# Altium project PT-15-V1.0.PrjPcb (part 3 of 7)

## Sheet 04-ORIN_HIGH_SPEED_SIGNAL_2.SchDoc: KARGOBOT-TBOX-V2.0
size 513 x 386 mm; Page Create Date: March  8, 1995; Page Number: 7; Page Size: C; Page Count: 81; RevCode: A; DsnPath: C:\Users\Administrator\Desktop\123\KARGOBOT-TCU-ORIN-V1.1.DSN; SchematicName: KARGOBT-TCU-ORIN-V1.1; PageName: 07-ORIN_HIGH_SPEED_SIGNAL_2; PageSize: C; TopSchematic: True
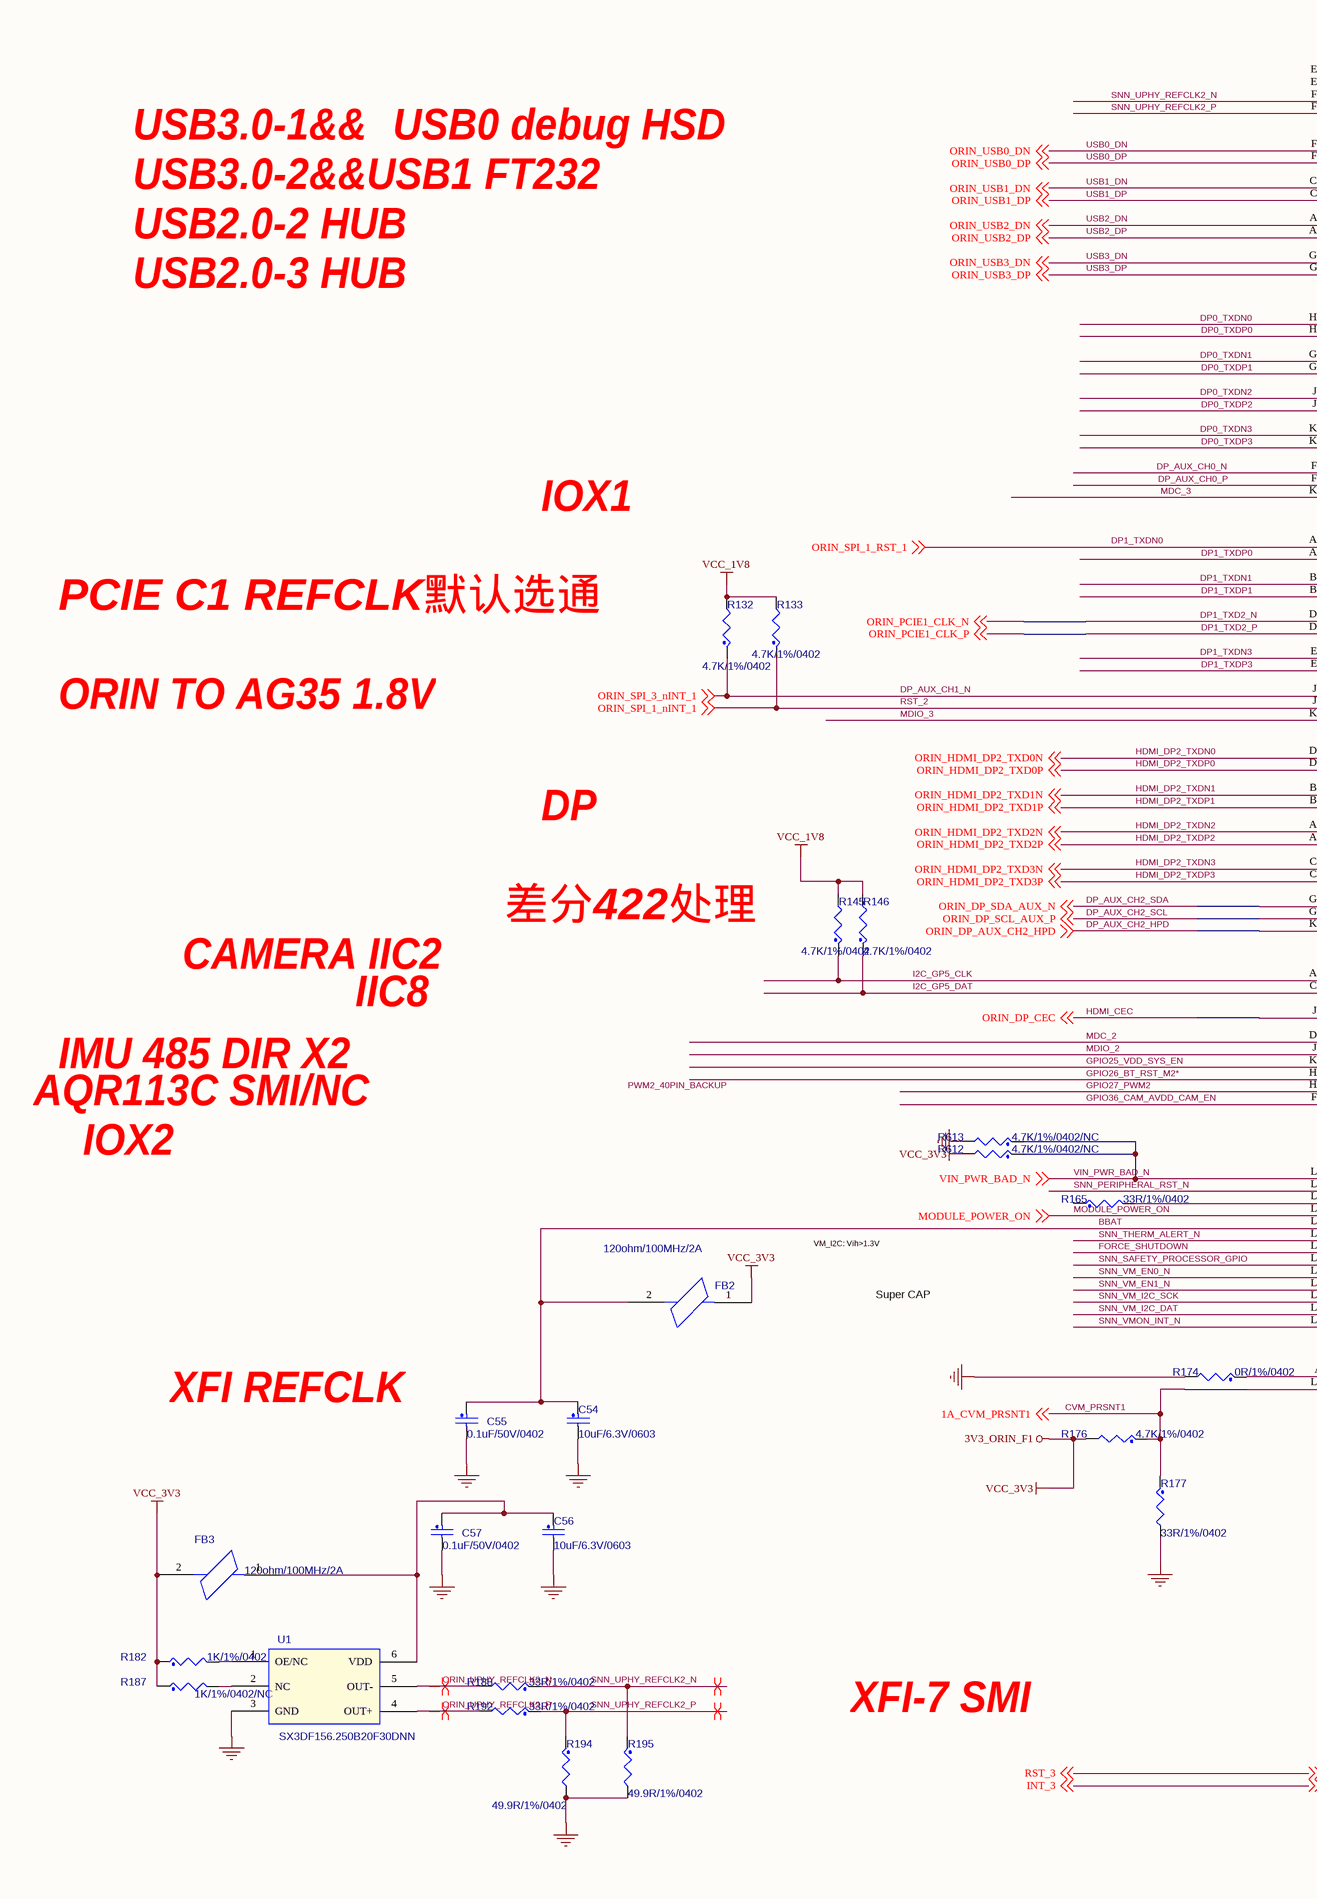
[diagram p6: 04-ORIN_HIGH_SPEED_SIGNAL_2.SchDoc, left]
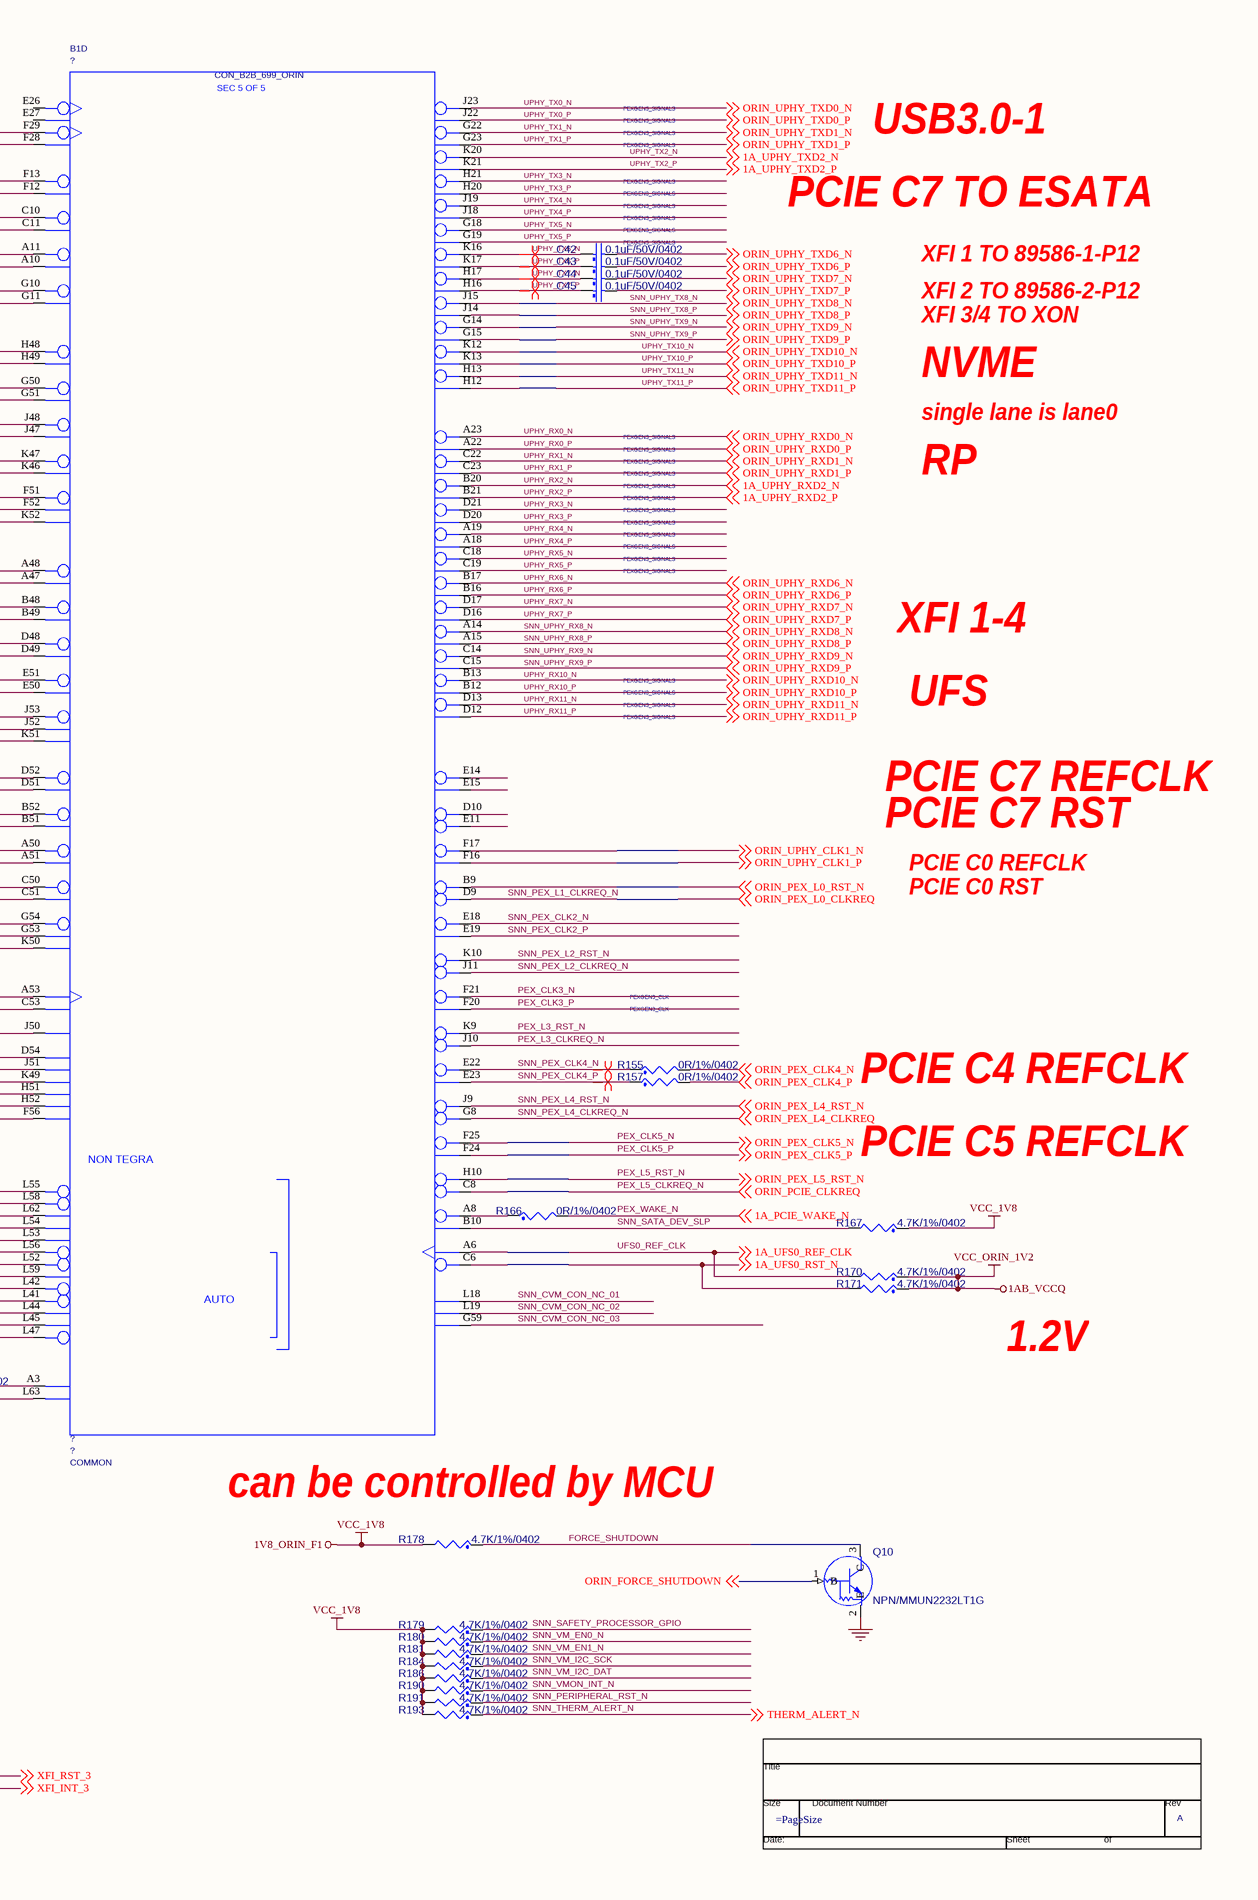
[diagram p7: 04-ORIN_HIGH_SPEED_SIGNAL_2.SchDoc, right]

### Parts
(Parts that share a designator on the sheet are numbered #1, #2 ... from top to bottom, then left to right.)
*#4  RevCode: A  (graphical)
B1  SKU: COMMON  [CON_MIRMEZ_699_BGA_ST_P009_P013_P015_REVERSE]  (hidden comment: CON_B2B_699_ORIN)  (part D of 5)
C42  value 0.1uF/50V/0402  [C0402]  (hidden comment: CAP_NP)
C43  value 0.1uF/50V/0402  [C0402]  (hidden comment: CAP_NP)
C44  value 0.1uF/50V/0402  [C0402]  (hidden comment: CAP_NP)
C45  value 0.1uF/50V/0402  [C0402]  (hidden comment: CAP_NP)
C54  value 10uF/6.3V/0603  [C0603]  (hidden comment: CAP_NP)
C55  value 0.1uF/50V/0402  [C0402]  (hidden comment: CAP_NP)
C56  value 10uF/6.3V/0603  [C0603]  (hidden comment: CAP_NP)
C57  value 0.1uF/50V/0402  [C0402]  (hidden comment: CAP_NP)
FB2  value 120ohm/100MHz/2A  [L0603]  (hidden comment: BEAD_FERRITE)
FB3  value 120ohm/100MHz/2A  [L0603]  (hidden comment: BEAD_FERRITE)
Q10  NPN/MMUN2232LT1G  [SOT-23]
R132  value 4.7K/1%/0402  [R0402]  (hidden comment: RES_Dup2)
R133  value 4.7K/1%/0402  [R0402]  (hidden comment: RES_Dup2)
R145  value 4.7K/1%/0402  [R0402]  (hidden comment: RES_Dup2)
R146  value 4.7K/1%/0402  [R0402]  (hidden comment: RES_Dup2)
R155  value 0R/1%/0402  [R0402]  (hidden comment: RES_Dup2)
R157  value 0R/1%/0402  [R0402]  (hidden comment: RES_Dup2)
R165  value 33R/1%/0402  [R0402]  (hidden comment: RES_Dup2)
R166  value 0R/1%/0402  [R0402]  (hidden comment: RES_Dup2)
R167  value 4.7K/1%/0402  [R0402]  (hidden comment: RES_Dup2)
R170  value 4.7K/1%/0402  [R0402]  (hidden comment: RES_Dup2)
R171  value 4.7K/1%/0402  [R0402]  (hidden comment: RES_Dup2)
R174  value 0R/1%/0402  [R0402]  (hidden comment: RES_Dup2)
R176  value 4.7K/1%/0402  [R0402]  (hidden comment: RES_Dup2)
R177  value 33R/1%/0402  [R0402]  (hidden comment: RES_Dup2)
R178  value 4.7K/1%/0402  [R0402]  (hidden comment: RES_Dup2)
R179  value 4.7K/1%/0402  [R0402]  (hidden comment: RES_Dup2)
R180  value 4.7K/1%/0402  [R0402]  (hidden comment: RES_Dup2)
R181  value 4.7K/1%/0402  [R0402]  (hidden comment: RES_Dup2)
R182  value 1K/1%/0402  [R0402]  (hidden comment: RES_Dup2)
R184  value 4.7K/1%/0402  [R0402]  (hidden comment: RES_Dup2)
R186  value 4.7K/1%/0402  [R0402]  (hidden comment: RES_Dup2)
R187  value 1K/1%/0402/NC  [R0402]  (hidden comment: RES_Dup2)
R188  value 33R/1%/0402  [R0402]  (hidden comment: RES_Dup2)
R190  value 4.7K/1%/0402  [R0402]  (hidden comment: RES_Dup2)
R191  value 4.7K/1%/0402  [R0402]  (hidden comment: RES_Dup2)
R192  value 33R/1%/0402  [R0402]  (hidden comment: RES_Dup2)
R193  value 4.7K/1%/0402  [R0402]  (hidden comment: RES_Dup2)
R194  value 49.9R/1%/0402  [R0402]  (hidden comment: RES_Dup2)
R195  value 49.9R/1%/0402  [R0402]  (hidden comment: RES_Dup2)
R612  value 4.7K/1%/0402/NC  [R0402]  (hidden comment: RES_Dup2)
R613  value 4.7K/1%/0402/NC  [R0402]  (hidden comment: RES_Dup2)
U1  SX3DF156.250B20F30DNN  [SX3DF156.250B20F30DNN]

### Nets
1AB_VCCQ: R170.1 R171.1  [also labelled VCC_ORIN_1V2]
1V8_ORIN_F1: R132.2 R133.2 R145.2 R146.2 R167.1 R178.2 R179.2 R180.2 R181.2 R184.2 R186.2 R190.2 R191.2 R193.2  [also labelled VCC_1V8]
3V3_ORIN_F1: FB2.1 FB3.2 R176.2 R182.1 R187.1 R612.2  [also labelled VCC_3V3]
GND: C54.2 C55.2 C56.2 C57.2 Q10.2(E) R174.2 R177.2 R194.2 R195.2 R613.2 U1.3(GND)
1A_UFS0_RST_N: B1.C6(UFS0_RST_N) R171.2 ; off-sheet 1A_UFS0_RST_N
BBAT: B1.L53(VCC_RTC) C54.1 C55.1 FB2.2
CVM_PRSNT1: B1.L63(PRSNT1) R176.1 R177.1 ; off-sheet 1A_CVM_PRSNT1  [also labelled 1A_CVM_PRSNT1]
DP0_TXDN0: B1.H48(HDMI_DP0_TX0_N)
DP0_TXDN1: B1.G50(HDMI_DP0_TX1_N)
DP0_TXDN2: B1.J48(HDMI_DP0_TX2_N)
DP0_TXDN3: B1.K47(HDMI_DP0_TX3_N)
DP0_TXDP0: B1.H49(HDMI_DP0_TX0_P)
DP0_TXDP1: B1.G51(HDMI_DP0_TX1_P)
DP0_TXDP2: B1.J47(HDMI_DP0_TX2_P)
DP0_TXDP3: B1.K46(HDMI_DP0_TX3_P)
DP1_TXD2_N: B1.D48(HDMI_DP1_TX2_N) ; off-sheet ORIN_PCIE1_CLK_N  [also labelled ORIN_PCIE1_CLK_N]
DP1_TXD2_P: B1.D49(HDMI_DP1_TX2_P) ; off-sheet ORIN_PCIE1_CLK_P  [also labelled ORIN_PCIE1_CLK_P]
DP1_TXDN0: B1.A48(HDMI_DP1_TX0_N) ; off-sheet ORIN_SPI_1_RST_1  [also labelled ORIN_SPI_1_RST_1]
DP1_TXDN1: B1.B48(HDMI_DP1_TX1_N)
DP1_TXDN3: B1.E51(HDMI_DP1_TX3_N)
DP1_TXDP0: B1.A47(HDMI_DP1_TX0_P)
DP1_TXDP1: B1.B49(HDMI_DP1_TX1_P)
DP1_TXDP3: B1.E50(HDMI_DP1_TX3_P)
DP_AUX_CH0_N: B1.F51(DP0_AUX_CH_N)
DP_AUX_CH0_P: B1.F52(DP0_AUX_CH_P)
DP_AUX_CH1_N: B1.J53(DP1_AUX_CH_N) R132.1 ; off-sheet ORIN_SPI_3_nINT_1  [also labelled ORIN_SPI_3_nINT_1]
DP_AUX_CH2_HPD: B1.K50(DP2_HPD) ; off-sheet ORIN_DP_AUX_CH2_HPD  [also labelled ORIN_DP_AUX_CH2_HPD]
DP_AUX_CH2_SCL: B1.G53(DP2_AUX_CH_P) ; off-sheet ORIN_DP_SCL_AUX_P  [also labelled ORIN_DP_SCL_AUX_P]
DP_AUX_CH2_SDA: B1.G54(DP2_AUX_CH_N) ; off-sheet ORIN_DP_SDA_AUX_N  [also labelled ORIN_DP_SDA_AUX_N]
FORCE_SHUTDOWN: B1.L52(OVERTEMP_N) Q10.3(C) R178.1
GPIO25_VDD_SYS_EN: B1.K49(GPIO25)
GPIO26_BT_RST_M2*: B1.H51(GPIO26)
GPIO27_PWM2: B1.H52(GPIO27)
GPIO36_CAM_AVDD_CAM_EN: B1.F56(GPIO36)
HDMI_CEC: B1.J50(HDMI_CEC) ; off-sheet ORIN_DP_CEC  [also labelled ORIN_DP_CEC]
HDMI_DP2_TXDN0: B1.D52(HDMI_DP2_TX0_N) ; off-sheet ORIN_HDMI_DP2_TXD0N  [also labelled ORIN_HDMI_DP2_TXD0N]
HDMI_DP2_TXDN1: B1.B52(HDMI_DP2_TX1_N) ; off-sheet ORIN_HDMI_DP2_TXD1N  [also labelled ORIN_HDMI_DP2_TXD1N]
HDMI_DP2_TXDN2: B1.A50(HDMI_DP2_TX2_N) ; off-sheet ORIN_HDMI_DP2_TXD2N  [also labelled ORIN_HDMI_DP2_TXD2N]
HDMI_DP2_TXDN3: B1.C50(HDMI_DP2_TX3_N) ; off-sheet ORIN_HDMI_DP2_TXD3N  [also labelled ORIN_HDMI_DP2_TXD3N]
HDMI_DP2_TXDP0: B1.D51(HDMI_DP2_TX0_P) ; off-sheet ORIN_HDMI_DP2_TXD0P  [also labelled ORIN_HDMI_DP2_TXD0P]
HDMI_DP2_TXDP1: B1.B51(HDMI_DP2_TX1_P) ; off-sheet ORIN_HDMI_DP2_TXD1P  [also labelled ORIN_HDMI_DP2_TXD1P]
HDMI_DP2_TXDP2: B1.A51(HDMI_DP2_TX2_P) ; off-sheet ORIN_HDMI_DP2_TXD2P  [also labelled ORIN_HDMI_DP2_TXD2P]
HDMI_DP2_TXDP3: B1.C51(HDMI_DP2_TX3_P) ; off-sheet ORIN_HDMI_DP2_TXD3P  [also labelled ORIN_HDMI_DP2_TXD3P]
I2C_GP5_CLK: B1.A53(I2C5_CLK) R145.1
I2C_GP5_DAT: B1.C53(I2C5_DAT) R146.1
INT_3: off-sheet INT_3, off-sheet XFI_INT_3  [also labelled XFI_INT_3]  [project net SNN_NVHS_SLVS_RX7_P]
MDC_2: B1.D54(GPIO03)
MDC_3: B1.K52(DP0_HPD)
MDIO_2: B1.J51(GPIO24)
MDIO_3: B1.K51(DP1_HPD)
MODULE_POWER_ON: B1.L54(MODULE_POWER_ON) ; off-sheet MODULE_POWER_ON
ORIN_FORCE_SHUTDOWN: Q10.1(B) ; off-sheet ORIN_FORCE_SHUTDOWN
ORIN_PEX_CLK4_N: R155.2 ; off-sheet ORIN_PEX_CLK4_N
ORIN_PEX_CLK4_P: R157.2 ; off-sheet ORIN_PEX_CLK4_P
ORIN_PEX_L0_RST_N: B1.B9(PEX_C1_RST_N) ; off-sheet ORIN_PEX_L0_RST_N
ORIN_UPHY_CLK1_N: B1.F17(UPHY_REFCLK1_N) ; off-sheet ORIN_UPHY_CLK1_N
ORIN_UPHY_CLK1_P: B1.F16(UPHY_REFCLK1_P) ; off-sheet ORIN_UPHY_CLK1_P
ORIN_UPHY_REFCLK2_N: R188.2 U1.5(OUT-)
ORIN_UPHY_REFCLK2_P: R192.2 U1.4(OUT+)
ORIN_UPHY_TXD6_N: C42.2 ; off-sheet ORIN_UPHY_TXD6_N
ORIN_UPHY_TXD6_P: C43.2 ; off-sheet ORIN_UPHY_TXD6_P
ORIN_UPHY_TXD7_N: C44.2 ; off-sheet ORIN_UPHY_TXD7_N
ORIN_UPHY_TXD7_P: C45.2 ; off-sheet ORIN_UPHY_TXD7_P
PEX_CLK3_N: B1.F21(PEX_CLK3_N)
PEX_CLK3_P: B1.F20(PEX_CLK3_P)
PEX_CLK5_N: B1.F25(PEX_CLK5_N) ; off-sheet ORIN_PEX_CLK5_N  [also labelled ORIN_PEX_CLK5_N]
PEX_CLK5_P: B1.F24(PEX_CLK5_P) ; off-sheet ORIN_PEX_CLK5_P  [also labelled ORIN_PEX_CLK5_P]
PEX_L3_CLKREQ_N: B1.J10(PEX_C3_CLKREQ_N)
PEX_L3_RST_N: B1.K9(PEX_C3_RST_N)
PEX_L5_CLKREQ_N: B1.C8(PEX_C5_CLKREQ_N) ; off-sheet ORIN_PCIE_CLKREQ  [also labelled ORIN_PCIE_CLKREQ]
PEX_L5_RST_N: B1.H10(PEX_C5_RST_N) ; off-sheet ORIN_PEX_L5_RST_N  [also labelled ORIN_PEX_L5_RST_N]
PEX_WAKE_N: R166.2 ; off-sheet 1A_PCIE_WAKE_N  [also labelled 1A_PCIE_WAKE_N]
RST_2: B1.J52(DP1_AUX_CH_P) R133.1 ; off-sheet ORIN_SPI_1_nINT_1  [also labelled ORIN_SPI_1_nINT_1]
RST_3: off-sheet RST_3, off-sheet XFI_RST_3  [also labelled XFI_RST_3]  [project net SNN_NVHS_SLVS_RX7_N]
SNN_CVM_CON_NC_01: B1.L18(NC_01)
SNN_CVM_CON_NC_02: B1.L19(NC_02)
SNN_CVM_CON_NC_03: B1.G59(NC_03)
SNN_PERIPHERAL_RST_N: B1.L58(PERIPHERAL_RESET_N) R191.1
SNN_PEX_CLK2_N: B1.E18(PEX_CLK2_N)
SNN_PEX_CLK2_P: B1.E19(PEX_CLK2_P)
SNN_PEX_CLK4_N: B1.E22(PEX_CLK4_N) R155.1
SNN_PEX_CLK4_P: B1.E23(PEX_CLK4_P) R157.1
SNN_PEX_L1_CLKREQ_N: B1.D9(PEX_C1_CLKREQ_N) ; off-sheet ORIN_PEX_L0_CLKREQ  [also labelled ORIN_PEX_L0_CLKREQ]
SNN_PEX_L2_CLKREQ_N: B1.J11(PEX_C2_CLKREQ_N)
SNN_PEX_L2_RST_N: B1.K10(PEX_C2_RST_N)
SNN_PEX_L4_CLKREQ_N: B1.G8(PEX_C4_CLKREQ_N) ; off-sheet ORIN_PEX_L4_CLKREQ  [also labelled ORIN_PEX_L4_CLKREQ]
SNN_PEX_L4_RST_N: B1.J9(PEX_C4_RST_N) ; off-sheet ORIN_PEX_L4_RST_N  [also labelled ORIN_PEX_L4_RST_N]
SNN_SAFETY_PROCESSOR_GPIO: B1.L59(SAFETY_PROCESSOR_GPIO) R179.1
SNN_SATA_DEV_SLP: B1.B10(SATA_DEV_SLP) R167.2
SNN_THERM_ALERT_N: B1.L56(TEMP_ALERT_N) R193.1 ; off-sheet THERM_ALERT_N  [also labelled THERM_ALERT_N]
SNN_UPHY_REFCLK2_N: B1.F29(UPHY_REFCLK2_N) R188.1 R195.1
SNN_UPHY_REFCLK2_P: B1.F28(UPHY_REFCLK2_P) R192.1 R194.1
SNN_UPHY_RX8_N: B1.A14(UPHY_RX8_N) ; off-sheet ORIN_UPHY_RXD8_N  [also labelled ORIN_UPHY_RXD8_N]
SNN_UPHY_RX8_P: B1.A15(UPHY_RX8_P) ; off-sheet ORIN_UPHY_RXD8_P  [also labelled ORIN_UPHY_RXD8_P]
SNN_UPHY_RX9_N: B1.C14(UPHY_RX9_N) ; off-sheet ORIN_UPHY_RXD9_N  [also labelled ORIN_UPHY_RXD9_N]
SNN_UPHY_RX9_P: B1.C15(UPHY_RX9_P) ; off-sheet ORIN_UPHY_RXD9_P  [also labelled ORIN_UPHY_RXD9_P]
SNN_UPHY_TX8_N: B1.J15(UPHY_TX8_N) ; off-sheet ORIN_UPHY_TXD8_N  [also labelled ORIN_UPHY_TXD8_N]
SNN_UPHY_TX8_P: B1.J14(UPHY_TX8_P) ; off-sheet ORIN_UPHY_TXD8_P  [also labelled ORIN_UPHY_TXD8_P]
SNN_UPHY_TX9_N: B1.G14(UPHY_TX9_N) ; off-sheet ORIN_UPHY_TXD9_N  [also labelled ORIN_UPHY_TXD9_N]
SNN_UPHY_TX9_P: B1.G15(UPHY_TX9_P) ; off-sheet ORIN_UPHY_TXD9_P  [also labelled ORIN_UPHY_TXD9_P]
SNN_VM_EN0_N: B1.L42(VM_EN0_N) R180.1
SNN_VM_EN1_N: B1.L41(VM_EN1_N) R181.1
SNN_VM_I2C_DAT: B1.L45(VM_I2C_DAT) R186.1
SNN_VM_I2C_SCK: B1.L44(VM_I2C_SCK) R184.1
SNN_VMON_INT_N: B1.L47(VM_INT_N) R190.1
UFS0_REF_CLK: B1.A6(UFS0_REF_CLK) R170.2 ; off-sheet 1A_UFS0_REF_CLK  [also labelled 1A_UFS0_REF_CLK]
UPHY_RX0_N: B1.A23(UPHY_RX0_N) ; off-sheet ORIN_UPHY_RXD0_N  [also labelled ORIN_UPHY_RXD0_N]
UPHY_RX0_P: B1.A22(UPHY_RX0_P) ; off-sheet ORIN_UPHY_RXD0_P  [also labelled ORIN_UPHY_RXD0_P]
UPHY_RX1_N: B1.C22(UPHY_RX1_N) ; off-sheet ORIN_UPHY_RXD1_N  [also labelled ORIN_UPHY_RXD1_N]
UPHY_RX1_P: B1.C23(UPHY_RX1_P) ; off-sheet ORIN_UPHY_RXD1_P  [also labelled ORIN_UPHY_RXD1_P]
UPHY_RX2_N: B1.B20(UPHY_RX2_N) ; off-sheet 1A_UPHY_RXD2_N  [also labelled 1A_UPHY_RXD2_N]
UPHY_RX2_P: B1.B21(UPHY_RX2_P) ; off-sheet 1A_UPHY_RXD2_P  [also labelled 1A_UPHY_RXD2_P]
UPHY_RX3_N: B1.D21(UPHY_RX3_N)
UPHY_RX3_P: B1.D20(UPHY_RX3_P)
UPHY_RX4_N: B1.A19(UPHY_RX4_N)
UPHY_RX4_P: B1.A18(UPHY_RX4_P)
UPHY_RX5_N: B1.C18(UPHY_RX5_N)
UPHY_RX5_P: B1.C19(UPHY_RX5_P)
UPHY_RX6_N: B1.B17(UPHY_RX6_N) ; off-sheet ORIN_UPHY_RXD6_N  [also labelled ORIN_UPHY_RXD6_N]
UPHY_RX6_P: B1.B16(UPHY_RX6_P) ; off-sheet ORIN_UPHY_RXD6_P  [also labelled ORIN_UPHY_RXD6_P]
UPHY_RX7_N: B1.D17(UPHY_RX7_N) ; off-sheet ORIN_UPHY_RXD7_N  [also labelled ORIN_UPHY_RXD7_N]
UPHY_RX7_P: B1.D16(UPHY_RX7_P) ; off-sheet ORIN_UPHY_RXD7_P  [also labelled ORIN_UPHY_RXD7_P]
UPHY_RX10_N: B1.B13(UPHY_RX10_N) ; off-sheet ORIN_UPHY_RXD10_N  [also labelled ORIN_UPHY_RXD10_N]
UPHY_RX10_P: B1.B12(UPHY_RX10_P) ; off-sheet ORIN_UPHY_RXD10_P  [also labelled ORIN_UPHY_RXD10_P]
UPHY_RX11_N: B1.D13(UPHY_RX11_N) ; off-sheet ORIN_UPHY_RXD11_N  [also labelled ORIN_UPHY_RXD11_N]
UPHY_RX11_P: B1.D12(UPHY_RX11_P) ; off-sheet ORIN_UPHY_RXD11_P  [also labelled ORIN_UPHY_RXD11_P]
UPHY_TX0_N: B1.J23(UPHY_TX0_N) ; off-sheet ORIN_UPHY_TXD0_N  [also labelled ORIN_UPHY_TXD0_N]
UPHY_TX0_P: B1.J22(UPHY_TX0_P) ; off-sheet ORIN_UPHY_TXD0_P  [also labelled ORIN_UPHY_TXD0_P]
UPHY_TX1_N: B1.G22(UPHY_TX1_N) ; off-sheet ORIN_UPHY_TXD1_N  [also labelled ORIN_UPHY_TXD1_N]
UPHY_TX1_P: B1.G23(UPHY_TX1_P) ; off-sheet ORIN_UPHY_TXD1_P  [also labelled ORIN_UPHY_TXD1_P]
UPHY_TX2_N: B1.K20(UPHY_TX2_N) ; off-sheet 1A_UPHY_TXD2_N  [also labelled 1A_UPHY_TXD2_N]
UPHY_TX2_P: B1.K21(UPHY_TX2_P) ; off-sheet 1A_UPHY_TXD2_P  [also labelled 1A_UPHY_TXD2_P]
UPHY_TX3_N: B1.H21(UPHY_TX3_N)
UPHY_TX3_P: B1.H20(UPHY_TX3_P)
UPHY_TX4_N: B1.J19(UPHY_TX4_N)
UPHY_TX4_P: B1.J18(UPHY_TX4_P)
UPHY_TX5_N: B1.G18(UPHY_TX5_N)
UPHY_TX5_P: B1.G19(UPHY_TX5_P)
UPHY_TX6_N: B1.K16(UPHY_TX6_N) C42.1
UPHY_TX6_P: B1.K17(UPHY_TX6_P) C43.1
UPHY_TX7_N: B1.H17(UPHY_TX7_N) C44.1
UPHY_TX7_P: B1.H16(UPHY_TX7_P) C45.1
UPHY_TX10_N: B1.K12(UPHY_TX10_N) ; off-sheet ORIN_UPHY_TXD10_N  [also labelled ORIN_UPHY_TXD10_N]
UPHY_TX10_P: B1.K13(UPHY_TX10_P) ; off-sheet ORIN_UPHY_TXD10_P  [also labelled ORIN_UPHY_TXD10_P]
UPHY_TX11_N: B1.H13(UPHY_TX11_N) ; off-sheet ORIN_UPHY_TXD11_N  [also labelled ORIN_UPHY_TXD11_N]
UPHY_TX11_P: B1.H12(UPHY_TX11_P) ; off-sheet ORIN_UPHY_TXD11_P  [also labelled ORIN_UPHY_TXD11_P]
USB0_DN: B1.F13(USB0_N) ; off-sheet ORIN_USB0_DN  [also labelled ORIN_USB0_DN]
USB0_DP: B1.F12(USB0_P) ; off-sheet ORIN_USB0_DP  [also labelled ORIN_USB0_DP]
USB1_DN: B1.C10(USB1_N) ; off-sheet ORIN_USB1_DN  [also labelled ORIN_USB1_DN]
USB1_DP: B1.C11(USB1_P) ; off-sheet ORIN_USB1_DP  [also labelled ORIN_USB1_DP]
USB2_DN: B1.A11(USB2_N) ; off-sheet ORIN_USB2_DN  [also labelled ORIN_USB2_DN]
USB2_DP: B1.A10(USB2_P) ; off-sheet ORIN_USB2_DP  [also labelled ORIN_USB2_DP]
USB3_DN: B1.G10(USB3_N) ; off-sheet ORIN_USB3_DN  [also labelled ORIN_USB3_DN]
USB3_DP: B1.G11(USB3_P) ; off-sheet ORIN_USB3_DP  [also labelled ORIN_USB3_DP]
VIN_PWR_BAD_N: B1.L55(VDDIN_PWR_BAD_N) R612.1 R613.1 ; off-sheet VIN_PWR_BAD_N
NetB1_A3: B1.A3(PRSNT0) R174.1
NetB1_A8: B1.A8(PEX_WAKE_N) R166.1
NetB1_L62: B1.L62(CARRIER_POWER_ON) R165.2
NetC56_1: C56.1 C57.1 FB3.1 U1.6(VDD)
NetR182_2: R182.2 U1.1(OE/NC)
NetR187_2: R187.2 U1.2(NC)

Not connected (* = marked no-connect by the designer): B1 D10(PEX_C0_RST_N) E11(PEX_C0_CLKREQ_N) E14(PEX_CLK0_N) E15(PEX_CLK0_P) E26(UPHY_REFCLK6_N) E27(UPHY_REFCLK6_P); R165 1

### Layout directives
differential pair: ORIN_UPHY_REFCLK2_N, ORIN_UPHY_REFCLK2_P, SNN_PEX_CLK4_N, SNN_PEX_CLK4_P, SNN_UPHY_REFCLK2_N, SNN_UPHY_REFCLK2_P, UPHY_TX6_N, UPHY_TX6_P, UPHY_TX7_N, UPHY_TX7_P

### Notes on the sheet
- PEXGEN3_SIGNALS
- USB3.0-1&&
- USB0 debug HSD
- USB3.0-1
- USB3.0-2&&USB1 FT232
- PCIE C7 TO ESATA
- USB2.0-2 HUB
- XFI 2 TO 89586-2-P12
- XFI 1 TO 89586-1-P12
- USB2.0-3 HUB
- XFI 3/4 TO XON
- NVME
- single lane is lane0
- RP
- IOX1
- PCIE C1 REFCLK默认选通
- XFI 1-4
- UFS
- ORIN TO AG35 1.8V
- DP
- PCIE C7 REFCLK
- PCIE C7 RST
- PCIE C0 REFCLK
- PCIE C0 RST
- 差分422处理
- CAMERA IIC2
- IIC8
- PEXGEN3_CLK
- IMU 485 DIR X2
- PCIE C4 REFCLK
- AQR113C SMI/NC
- IOX2
- PCIE C5 REFCLK
- VM_I2C: Vih>1.3V
- Super CAP
- 1.2V
- XFI REFCLK
- (near R178) can be controlled by MCU
- XFI-7 SMI
- Labels drawn without touching a wire or pin: PWM2_40PIN_BACKUP
- (in symbol CON_B2B_699, part D) SEC 5 OF 5; NON TEGRA; AUTO
- (in symbol TitleBlock0) Title; Size; Document Number; Rev; Date:; Sheet; of

### Library data of the parts
*#4 = TitleBlock0: Title: KARGOBOT-TBOX-V2.0; Page Number: 7; Page Count: 81; Page Create Date: March  8, 1995; Page Size: =PageSize; Page Modify Date: =ModifiedDate
B1 = CON_B2B_699: 2034560003/MOLEX; Part Reference: B1; OriginalSymbolOrigin: (-500,1750); ASSEMBLY: ?; DEVICE: CON_B2B_699_ORIN; NV_PN: ?; PACK_TYPE: ?; PATH: ?; PLACEMENT_NOTE: ?; Value: CON_B2B_699_ORIN; PCB Footprint: CON_MIRMEZ_699_BGA_ST_P009_P013_P015_REVERSE
C42 = CAP_NP: GCM155R71H104KE02/MURATA; Part Reference: C37; CLASS: DISCRETE; FPLIST: CC0402_25,CC0402_HD,CC0402_CC; CAD_APPROVED: Yes; MFG_PN01: 0402YC104KAT2A; MFG_NAME01: AVX; Tolerance: 10%; AGILE_PN: 150-75182; VOLTAGE: 16V; HEIGHT: 0.635MM; ROHS: Yes; TOL: 10%; PCB Footprint: C0402
C43 = CAP_NP: GCM155R71H104KE02/MURATA; Part Reference: C38; CLASS: DISCRETE; FPLIST: CC0402_25,CC0402_HD,CC0402_CC; CAD_APPROVED: Yes; MFG_PN01: 0402YC104KAT2A; MFG_NAME01: AVX; Tolerance: 10%; AGILE_PN: 150-75182; VOLTAGE: 16V; HEIGHT: 0.635MM; ROHS: Yes; TOL: 10%; PCB Footprint: C0402
C44 = CAP_NP: GCM155R71H104KE02/MURATA; Part Reference: C39; CLASS: DISCRETE; FPLIST: CC0402_25,CC0402_HD,CC0402_CC; CAD_APPROVED: Yes; MFG_PN01: 0402YC104KAT2A; MFG_NAME01: AVX; Tolerance: 10%; AGILE_PN: 150-75182; VOLTAGE: 16V; HEIGHT: 0.635MM; ROHS: Yes; TOL: 10%; PCB Footprint: C0402
C45 = CAP_NP: GCM155R71H104KE02/MURATA; Part Reference: C40; CLASS: DISCRETE; FPLIST: CC0402_25,CC0402_HD,CC0402_CC; CAD_APPROVED: Yes; MFG_PN01: 0402YC104KAT2A; MFG_NAME01: AVX; Tolerance: 10%; AGILE_PN: 150-75182; VOLTAGE: 16V; HEIGHT: 0.635MM; ROHS: Yes; TOL: 10%; PCB Footprint: C0402
C54 = CAP_NP: GCM188D70J106ME36/MURATA; Part Reference: C46; CLASS: DISCRETE; VOLTAGE: 10v; CAD_APPROVED: Yes; MFG_PN01: C1608X5R1A106K; MFG_NAME01: TDK; TOL: 10%; AGILE_PN: 150-78675; FPLIST: CC0603_OV,CC0603,0603_CC; HEIGHT: 1.016MM; ROHS: Yes; Tolerance: 10%; PCB Footprint: C0603
C55 = CAP_NP: GCM155R71H104KE02/MURATA; Part Reference: C45; CLASS: DISCRETE; FPLIST: CC0402_25,CC0402_HD,CC0402_CC; CAD_APPROVED: Yes; MFG_PN01: 0402YC104KAT2A; MFG_NAME01: AVX; Tolerance: 10%; AGILE_PN: 150-75182; VOLTAGE: 16V; HEIGHT: 0.635MM; ROHS: Yes; TOL: 10%; PCB Footprint: C0402
C56 = CAP_NP: GCM188D70J106ME36/MURATA; Part Reference: C48; CLASS: DISCRETE; VOLTAGE: 10v; CAD_APPROVED: Yes; MFG_PN01: C1608X5R1A106K; MFG_NAME01: TDK; TOL: 10%; AGILE_PN: 150-78675; FPLIST: CC0603_OV,CC0603,0603_CC; HEIGHT: 1.016MM; ROHS: Yes; Tolerance: 10%; PCB Footprint: C0603
C57 = CAP_NP: GCM155R71H104KE02/MURATA; Part Reference: C47; CLASS: DISCRETE; FPLIST: CC0402_25,CC0402_HD,CC0402_CC; CAD_APPROVED: Yes; MFG_PN01: 0402YC104KAT2A; MFG_NAME01: AVX; Tolerance: 10%; AGILE_PN: 150-75182; VOLTAGE: 16V; HEIGHT: 0.635MM; ROHS: Yes; TOL: 10%; PCB Footprint: C0402
FB2 = BEAD_FERRITE: BLM18EG121SH1D/MURATA; Part Reference: FB1; PART_TYPE: FERRITE\BEAD; CLASS: DISCRETE; FPLIST: IND_0603A,0603_CC; CAD_APPROVED: Yes; MFG_PN01: BLM18KG121TN1; MFG_NAME01: MURATA; AGILE_PN: 180-78025; HEIGHT: 0.75MM; ROHS: Yes; PCB Footprint: L0603
FB3 = BEAD_FERRITE: BLM18EG121SH1D/MURATA; Part Reference: FB2; PART_TYPE: FERRITE\BEAD; CLASS: DISCRETE; AGILE_PN: 180-78025; MFG_NAME01: MURATA; MFG_PN01: BLM18KG121TN1; CAD_APPROVED: Yes; FPLIST: IND_0603A,0603_CC; ROHS: Yes; HEIGHT: 0.75MM; PCB Footprint: L0603
Q10 = DTC143ZE: MMUN2232LT1G/ONSEMI; Part Reference: Q1; Value: NPN/MMUN2232LT1G; PCB Footprint: SOT-23
R132 = RES_Dup2: AC0402FR-074K7L/YAGEO; Part Reference: R147; CLASS: DISCRETE; FPLIST: RC0402_25,RC0402_HD,RC0402_CC; CAD_APPROVED: Yes; MFG_PN01: RK73B1ETTP472J; MFG_NAME01: KOA SPEER; Tolerance: 5%; AGILE_PN: 470-75626; PCB Footprint: R0402; ROHS: Yes; TOL: 5%; HEIGHT: 0.41mm
R133 = RES_Dup2: AC0402FR-074K7L/YAGEO; Part Reference: R148; CLASS: DISCRETE; FPLIST: RC0402_25,RC0402_HD,RC0402_CC; CAD_APPROVED: Yes; MFG_PN01: RK73B1ETTP472J; MFG_NAME01: KOA SPEER; Tolerance: 5%; AGILE_PN: 470-75626; ROHS: Yes; TOL: 5%; HEIGHT: 0.41mm; PCB Footprint: R0402
R145 = RES_Dup2: AC0402FR-074K7L/YAGEO; Part Reference: R160; CLASS: DISCRETE; TOL: 5%; AGILE_PN: 470-75626; MFG_NAME01: KOA SPEER; MFG_PN01: RK73B1ETTP472J; CAD_APPROVED: Yes; FPLIST: RC0402_25,RC0402_HD,RC0402_CC; HEIGHT: 0.41mm; Tolerance: 5%; ROHS: Yes; PCB Footprint: R0402
R146 = RES_Dup2: AC0402FR-074K7L/YAGEO; Part Reference: R161; CLASS: DISCRETE; FPLIST: RC0402_25,RC0402_HD,RC0402_CC; CAD_APPROVED: Yes; MFG_PN01: RK73B1ETTP472J; MFG_NAME01: KOA SPEER; Tolerance: 5%; AGILE_PN: 470-75626; ROHS: Yes; TOL: 5%; HEIGHT: 0.41mm; PCB Footprint: R0402
R155 = RES_Dup2: AC0402FR-070RL/YAGEO; Part Reference: R4924; CLASS: DISCRETE; TOL: 5%; AGILE_PN: 470-75790; Tolerance: 1%; MFG_NAME01: YAGEO; MFG_PN01: CR-02FL6---33R; CAD_APPROVED: Yes; FPLIST: RC0603_OV; SIGNAL_MODEL: DEFAULT_RESISTOR_33.000000OHM_2_1; HEIGHT: 0.4MM; ROHS: Yes; PCB Footprint: R0402
R157 = RES_Dup2: AC0402FR-070RL/YAGEO; Part Reference: R4925; CLASS: DISCRETE; TOL: 5%; AGILE_PN: 470-75790; Tolerance: 1%; MFG_NAME01: YAGEO; MFG_PN01: CR-02FL6---33R; CAD_APPROVED: Yes; FPLIST: RC0603_OV; SIGNAL_MODEL: DEFAULT_RESISTOR_33.000000OHM_2_1; HEIGHT: 0.4MM; ROHS: Yes; PCB Footprint: R0402
R165 = RES_Dup2: AC0402FR-0733RL/YAGEO; Part Reference: R178; CLASS: DISCRETE; TOL: 5%; AGILE_PN: 470-75790; Tolerance: 1%; MFG_NAME01: YAGEO; MFG_PN01: CR-02FL6---33R; CAD_APPROVED: Yes; FPLIST: RC0603_OV; SIGNAL_MODEL: DEFAULT_RESISTOR_33.000000OHM_2_1; HEIGHT: 0.4MM; ROHS: Yes; PCB Footprint: R0402
R166 = RES_Dup2: AC0402FR-070RL/YAGEO; Part Reference: R179; CLASS: DISCRETE; SIGNAL_MODEL: DEFAULT_RESISTOR_33.000000OHM_2_1; FPLIST: RC0603_OV; CAD_APPROVED: Yes; MFG_PN01: CR-02FL6---33R; MFG_NAME01: YAGEO; Tolerance: 1%; AGILE_PN: 470-75790; TOL: 5%; ROHS: Yes; HEIGHT: 0.4MM; PCB Footprint: R0402
R167 = RES_Dup2: AC0402FR-074K7L/YAGEO; Part Reference: R180; CLASS: DISCRETE; FPLIST: RC0402_25,RC0402_HD,RC0402_CC; CAD_APPROVED: Yes; MFG_PN01: RK73B1ETTP472J; MFG_NAME01: KOA SPEER; Tolerance: 5%; AGILE_PN: 470-75626; ROHS: Yes; TOL: 5%; HEIGHT: 0.41mm; PCB Footprint: R0402
R170 = RES_Dup2: AC0402FR-074K7L/YAGEO; Part Reference: R183; CLASS: DISCRETE; TOL: 5%; AGILE_PN: 470-75626; MFG_NAME01: KOA SPEER; MFG_PN01: RK73B1ETTP472J; CAD_APPROVED: Yes; FPLIST: RC0402_25,RC0402_HD,RC0402_CC; HEIGHT: 0.41mm; Tolerance: 5%; ROHS: Yes; PCB Footprint: R0402
R171 = RES_Dup2: AC0402FR-074K7L/YAGEO; Part Reference: R184; CLASS: DISCRETE; FPLIST: RC0402_25,RC0402_HD,RC0402_CC; CAD_APPROVED: Yes; MFG_PN01: RK73B1ETTP472J; MFG_NAME01: KOA SPEER; Tolerance: 5%; AGILE_PN: 470-75626; ROHS: Yes; TOL: 5%; HEIGHT: 0.41mm; PCB Footprint: R0402
R174 = RES_Dup2: AC0402FR-070RL/YAGEO; Part Reference: R187; CLASS: DISCRETE; TOL: 5%; AGILE_PN: 470-75626; MFG_NAME01: KOA SPEER; MFG_PN01: RK73B1ETTP472J; CAD_APPROVED: Yes; FPLIST: RC0402_25,RC0402_HD,RC0402_CC; HEIGHT: 0.41mm; Tolerance: 5%; ROHS: Yes; PCB Footprint: R0402
R176 R612 R613 = RES_Dup2: AC0402FR-074K7L/YAGEO; Part Reference: R189; CLASS: DISCRETE; FPLIST: RC0402_25,RC0402_HD,RC0402_CC; CAD_APPROVED: Yes; MFG_PN01: RK73B1ETTP472J; MFG_NAME01: KOA SPEER; Tolerance: 5%; AGILE_PN: 470-75626; ROHS: Yes; TOL: 5%; HEIGHT: 0.41mm; PCB Footprint: R0402
R177 = RES_Dup2: AC0402FR-0733RL/YAGEO; Part Reference: R190; CLASS: DISCRETE; FPLIST: RC0402_25,RC0402_HD,RC0402_CC; CAD_APPROVED: Yes; MFG_PN01: RK73B1ETTP472J; MFG_NAME01: KOA SPEER; Tolerance: 5%; AGILE_PN: 470-75626; ROHS: Yes; TOL: 5%; HEIGHT: 0.41mm; PCB Footprint: R0402
R178 = RES_Dup2: AC0402FR-074K7L/YAGEO; Part Reference: R191; CLASS: DISCRETE; TOL: 5%; AGILE_PN: 470-75626; MFG_NAME01: KOA SPEER; MFG_PN01: RK73B1ETTP472J; CAD_APPROVED: Yes; FPLIST: RC0402_25,RC0402_HD,RC0402_CC; HEIGHT: 0.41mm; Tolerance: 5%; ROHS: Yes; PCB Footprint: R0402
R179 = RES_Dup2: AC0402FR-074K7L/YAGEO; Part Reference: R192; CLASS: DISCRETE; FPLIST: RC0402_25,RC0402_HD,RC0402_CC; CAD_APPROVED: Yes; MFG_PN01: RK73B1ETTP472J; MFG_NAME01: KOA SPEER; Tolerance: 5%; AGILE_PN: 470-75626; ROHS: Yes; TOL: 5%; HEIGHT: 0.41mm; PCB Footprint: R0402
R180 = RES_Dup2: AC0402FR-074K7L/YAGEO; Part Reference: R193; CLASS: DISCRETE; TOL: 5%; AGILE_PN: 470-75626; MFG_NAME01: KOA SPEER; MFG_PN01: RK73B1ETTP472J; CAD_APPROVED: Yes; FPLIST: RC0402_25,RC0402_HD,RC0402_CC; HEIGHT: 0.41mm; Tolerance: 5%; ROHS: Yes; PCB Footprint: R0402
R181 = RES_Dup2: AC0402FR-074K7L/YAGEO; Part Reference: R194; CLASS: DISCRETE; FPLIST: RC0402_25,RC0402_HD,RC0402_CC; CAD_APPROVED: Yes; MFG_PN01: RK73B1ETTP472J; MFG_NAME01: KOA SPEER; Tolerance: 5%; AGILE_PN: 470-75626; ROHS: Yes; TOL: 5%; HEIGHT: 0.41mm; PCB Footprint: R0402
R182 = RES_Dup2: AC0402FR-071KL/YAGEO; Part Reference: R195; CLASS: DISCRETE; TOL: 5%; AGILE_PN: 470-75555; MFG_NAME01: VISHAY INTERTECHNOLOGY; MFG_PN01: CRCW04021K00JNED; CAD_APPROVED: Yes; FPLIST: RC0402_25,RC0402_HD,RC0402_CC; 物料封装: R0402; HEIGHT: 0.41mm; Tolerance: 5%; ROHS: Yes; PCB Footprint: R0402
R184 = RES_Dup2: AC0402FR-074K7L/YAGEO; Part Reference: R197; CLASS: DISCRETE; TOL: 5%; AGILE_PN: 470-75626; MFG_NAME01: KOA SPEER; MFG_PN01: RK73B1ETTP472J; CAD_APPROVED: Yes; FPLIST: RC0402_25,RC0402_HD,RC0402_CC; HEIGHT: 0.41mm; Tolerance: 5%; ROHS: Yes; PCB Footprint: R0402
R186 = RES_Dup2: AC0402FR-074K7L/YAGEO; Part Reference: R199; CLASS: DISCRETE; FPLIST: RC0402_25,RC0402_HD,RC0402_CC; CAD_APPROVED: Yes; MFG_PN01: RK73B1ETTP472J; MFG_NAME01: KOA SPEER; Tolerance: 5%; AGILE_PN: 470-75626; ROHS: Yes; TOL: 5%; HEIGHT: 0.41mm; PCB Footprint: R0402
R187 = RES_Dup2: AC0402FR-071KL/YAGEO; Part Reference: R200; CLASS: DISCRETE; TOL: 5%; AGILE_PN: 470-75555; MFG_NAME01: VISHAY INTERTECHNOLOGY; MFG_PN01: CRCW04021K00JNED; CAD_APPROVED: Yes; FPLIST: RC0402_25,RC0402_HD,RC0402_CC; 物料封装: R0402; HEIGHT: 0.41mm; Tolerance: 5%; ROHS: Yes; PCB Footprint: R0402
R188 = RES_Dup2: AC0402FR-0733RL/YAGEO; Part Reference: R201; CLASS: DISCRETE; TOL: 5%; AGILE_PN: 470-75626; MFG_NAME01: KOA SPEER; MFG_PN01: RK73B1ETTP472J; CAD_APPROVED: Yes; FPLIST: RC0402_25,RC0402_HD,RC0402_CC; HEIGHT: 0.41mm; Tolerance: 5%; ROHS: Yes; PCB Footprint: R0402
R190 = RES_Dup2: AC0402FR-074K7L/YAGEO; Part Reference: R203; CLASS: DISCRETE; TOL: 5%; AGILE_PN: 470-75626; MFG_NAME01: KOA SPEER; MFG_PN01: RK73B1ETTP472J; CAD_APPROVED: Yes; FPLIST: RC0402_25,RC0402_HD,RC0402_CC; HEIGHT: 0.41mm; Tolerance: 5%; ROHS: Yes; PCB Footprint: R0402
R191 = RES_Dup2: AC0402FR-074K7L/YAGEO; Part Reference: R204; CLASS: DISCRETE; FPLIST: RC0402_25,RC0402_HD,RC0402_CC; CAD_APPROVED: Yes; MFG_PN01: RK73B1ETTP472J; MFG_NAME01: KOA SPEER; Tolerance: 5%; AGILE_PN: 470-75626; ROHS: Yes; TOL: 5%; HEIGHT: 0.41mm; PCB Footprint: R0402
R192 = RES_Dup2: AC0402FR-0733RL/YAGEO; Part Reference: R205; CLASS: DISCRETE; TOL: 5%; AGILE_PN: 470-75626; MFG_NAME01: KOA SPEER; MFG_PN01: RK73B1ETTP472J; CAD_APPROVED: Yes; FPLIST: RC0402_25,RC0402_HD,RC0402_CC; HEIGHT: 0.41mm; Tolerance: 5%; ROHS: Yes; PCB Footprint: R0402
R193 = RES_Dup2: AC0402FR-074K7L/YAGEO; Part Reference: R206; CLASS: DISCRETE; TOL: 5%; AGILE_PN: 470-75626; MFG_NAME01: KOA SPEER; MFG_PN01: RK73B1ETTP472J; CAD_APPROVED: Yes; FPLIST: RC0402_25,RC0402_HD,RC0402_CC; HEIGHT: 0.41mm; Tolerance: 5%; ROHS: Yes; PCB Footprint: R0402
R194 = RES_Dup2: AC0402FR-0749R9L/YAGEO; Part Reference: R207; CLASS: DISCRETE; FPLIST: RC0402_25,RC0402_HD,RC0402_CC; CAD_APPROVED: Yes; MFG_PN01: RK73B1ETTP472J; MFG_NAME01: KOA SPEER; Tolerance: 5%; AGILE_PN: 470-75626; ROHS: Yes; TOL: 5%; HEIGHT: 0.41mm; PCB Footprint: R0402
R195 = RES_Dup2: AC0402FR-0749R9L/YAGEO; Part Reference: R209; CLASS: DISCRETE; TOL: 5%; AGILE_PN: 470-75626; MFG_NAME01: KOA SPEER; MFG_PN01: RK73B1ETTP472J; CAD_APPROVED: Yes; FPLIST: RC0402_25,RC0402_HD,RC0402_CC; HEIGHT: 0.41mm; Tolerance: 5%; ROHS: Yes; PCB Footprint: R0402
U1 = SiT9365AI-4B2-33E156.25MHZ: SiT9365AI-4B2-33E156.25MHZ/SITIME; Part Reference: U1; PCB Footprint: X6-3225m-SIT9365AI-4B2-33E156_25MHZ; Value: SX3DF156.250B20F30DNN

## Sheet 05_RTL8211F.SchDoc
size 386 x 246 mm; Page Create Date: March  8, 1995; Page Number: 6; Page Size: B; Page Count: 8; DsnPath: C:\Users\Administrator\Desktop\123\KARGOBOT-TCU-ORIN-V1.1.DSN; SchematicName: KARGOBT-TCU-ORIN-V1.1; PageName: P6_RTL8211F/D; PageSize: B; TopSchematic: True
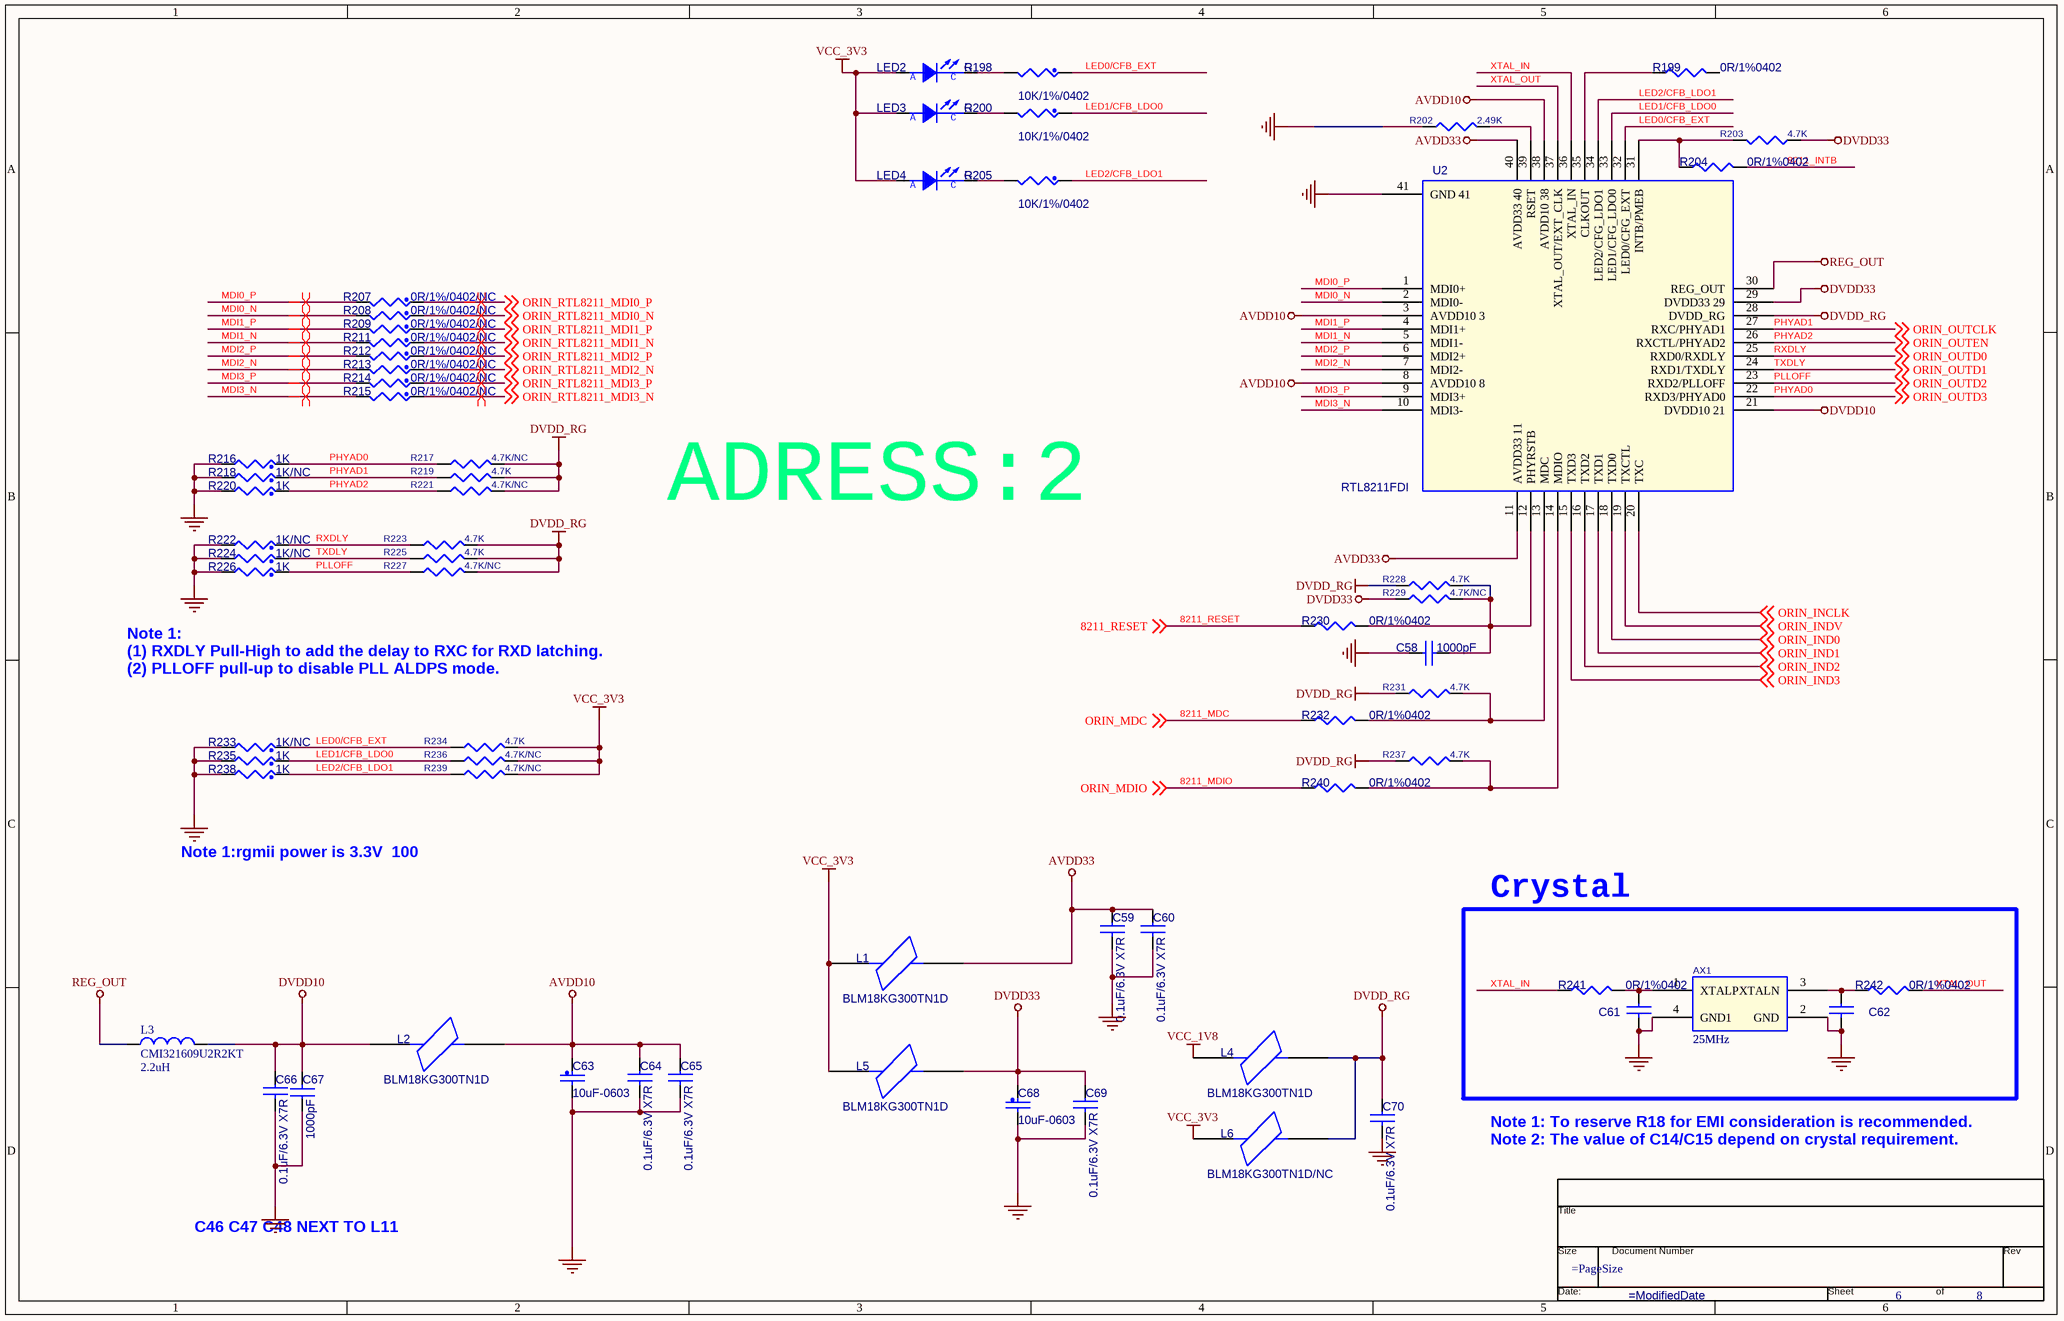
[diagram p8: 05_RTL8211F.SchDoc]

### Parts
(Parts that share a designator on the sheet are numbered #1, #2 ... from top to bottom, then left to right.)
*#5  Page Number: 6  Page Count: 8  (graphical)
AX1  25MHz  [2016]
C58  value 1000pF  [C0402]  (hidden comment: CAP NP_Dup4)
C59  value 0.1uF/6.3V X7R  [C0402]  (hidden comment: CAP NP_Dup4)
C60  value 0.1uF/6.3V X7R  [C0402]  (hidden comment: CAP NP_Dup4)
C61  CAP NP_Dup3  [C0402]  (value not drawn)
C62  CAP NP_Dup3  [C0402]  (value not drawn)
C63  value 10uF-0603  [C0603]  (hidden comment: CAP_NP)
C64  value 0.1uF/6.3V X7R  [C0402]  (hidden comment: CAP NP_Dup4)
C65  value 0.1uF/6.3V X7R  [C0402]  (hidden comment: CAP NP_Dup4)
C66  value 0.1uF/6.3V X7R  [C0402]  (hidden comment: CAP NP_Dup4)
C67  value 1000pF  [C0402]  (hidden comment: CAP NP_Dup4)
C68  value 10uF-0603  [C0603]  (hidden comment: CAP_NP)
C69  value 0.1uF/6.3V X7R  [C0402]  (hidden comment: CAP NP_Dup4)
C70  value 0.1uF/6.3V X7R  [C0402]  (hidden comment: CAP NP_Dup4)
L1  value BLM18KG300TN1D  [L0603]  (hidden comment: BEAD)
L2  value BLM18KG300TN1D  [L0603]  (hidden comment: BEAD)
L3  CMI321609U2R2KT  value 2.2uH  [L1206]
L4  value BLM18KG300TN1D  [L0603]  (hidden comment: BEAD)
L5  value BLM18KG300TN1D  [L0603]  (hidden comment: BEAD)
L6  value BLM18KG300TN1D/NC  [L0603]  (hidden comment: BEAD)
LED2  Value1: G  [LED0603]  (hidden comment: LED_P2_Dup1)
LED3  Value1: G  [LED0603]  (hidden comment: LED_P2_Dup1)
LED4  Value1: G  [LED0603]  (hidden comment: LED_P2_Dup1)
R198  value 10K/1%/0402  [R0402]  (hidden comment: RES_Dup2)
R199  value 0R/1%0402  [R0402]  (hidden comment: R_Dup3)
R200  value 10K/1%/0402  [R0402]  (hidden comment: RES_Dup2)
R202  value 2.49K  [R0402]  (hidden comment: RESISTOR)
R203  value 4.7K  [R0402]  (hidden comment: RESISTOR)
R204  value 0R/1%0402  [R0402]  (hidden comment: R_Dup3)
R205  value 10K/1%/0402  [R0402]  (hidden comment: RES_Dup2)
R207  value 0R/1%/0402/NC  [R0402]  (hidden comment: RES_Dup2)
R208  value 0R/1%/0402/NC  [R0402]  (hidden comment: RES_Dup2)
R209  value 0R/1%/0402/NC  [R0402]  (hidden comment: RES_Dup2)
R211  value 0R/1%/0402/NC  [R0402]  (hidden comment: RES_Dup2)
R212  value 0R/1%/0402/NC  [R0402]  (hidden comment: RES_Dup2)
R213  value 0R/1%/0402/NC  [R0402]  (hidden comment: RES_Dup2)
R214  value 0R/1%/0402/NC  [R0402]  (hidden comment: RES_Dup2)
R215  value 0R/1%/0402/NC  [R0402]  (hidden comment: RES_Dup2)
R216  value 1K  [R0402]  (hidden comment: RES_Dup2)
R217  value 4.7K/NC  [R0402]  (hidden comment: RESISTOR)
R218  value 1K/NC  [R0402]  (hidden comment: RES_Dup2)
R219  value 4.7K  [R0402]  (hidden comment: RESISTOR)
R220  value 1K  [R0402]  (hidden comment: RES_Dup2)
R221  value 4.7K/NC  [R0402]  (hidden comment: RESISTOR)
R222  value 1K/NC  [R0402]  (hidden comment: RES_Dup2)
R223  value 4.7K  [R0402]  (hidden comment: RESISTOR)
R224  value 1K/NC  [R0402]  (hidden comment: RES_Dup2)
R225  value 4.7K  [R0402]  (hidden comment: RESISTOR)
R226  value 1K  [R0402]  (hidden comment: RES_Dup2)
R227  value 4.7K/NC  [R0402]  (hidden comment: RESISTOR)
R228  value 4.7K  [R0402]  (hidden comment: RESISTOR)
R229  value 4.7K/NC  [R0402]  (hidden comment: RESISTOR)
R230  value 0R/1%0402  [R0402]  (hidden comment: R_Dup3)
R231  value 4.7K  [R0402]  (hidden comment: RESISTOR)
R232  value 0R/1%0402  [R0402]  (hidden comment: R_Dup3)
R233  value 1K/NC  [R0402]  (hidden comment: RES_Dup2)
R234  value 4.7K  [R0402]  (hidden comment: RESISTOR)
R235  value 1K  [R0402]  (hidden comment: RES_Dup2)
R236  value 4.7K/NC  [R0402]  (hidden comment: RESISTOR)
R237  value 4.7K  [R0402]  (hidden comment: RESISTOR)
R238  value 1K  [R0402]  (hidden comment: RES_Dup2)
R239  value 4.7K/NC  [R0402]  (hidden comment: RESISTOR)
R240  value 0R/1%0402  [R0402]  (hidden comment: R_Dup3)
R241  value 0R/1%0402  [R0402]  (hidden comment: R_Dup3)
R242  value 0R/1%0402  [R0402]  (hidden comment: R_Dup3)
U2  value RTL8211FDI  [RTL8211]  (hidden comment: TL8211FDI)

### Blocks framed on the sheet
Crystal: AX1 C61 C62 R241 R242

### Nets
AVDD10: C63.1 C64.1 C65.1 L2.2 U2.3(AVDD10_3) U2.8(AVDD10_8) U2.38(AVDD10_38)
AVDD33: C59.1 C60.1 L1.2 U2.11(AVDD33_11) U2.40(AVDD33_40)
DVDD10: C66.1 C67.2 L2.1 L3.2 U2.21(DVDD10_21)
DVDD33: C68.1 C69.1 L5.2 R203.1 R229.1 U2.29(DVDD33_29)
DVDD_RG: C70.1 L4.2 L6.2 R217.2 R219.2 R221.2 R223.2 R225.2 R227.2 R228.1 R231.1 R237.1 U2.28(DVDD_RG)
GND: AX1.2(GND) AX1.4(GND1) C58.1 C59.2 C60.2 C61.2 C62.2 C63.2 C64.2 C65.2 C66.2 C67.1 C68.2 C69.2 C70.2 R202.1 R216.2 R218.2 R220.2 R222.2 R224.2 R226.2 R233.2 R235.2 R238.2 U2.41(GND_41)
REG_OUT: L3.1 U2.30(REG_OUT)
VCC_1V8: L4.1  [project net 1V8_ORIN_F1]
VCC_3V3: L1.1 L5.1 L6.1 LED2.1(ANODE) LED3.1(ANODE) LED4.1(ANODE) R234.2 R236.2 R239.2  [project net 3V3_ORIN_F1]
8211_INTB: R204.2
8211_MDC: R232.1 ; off-sheet ORIN_MDC  [also labelled ORIN_MDC]
8211_MDIO: R240.1 ; off-sheet ORIN_MDIO  [also labelled ORIN_MDIO]
8211_RESET: R230.1 ; off-sheet 8211_RESET
LED0/CFB_EXT: R198.1 R233.1 R234.1 U2.32(LED0/CFG_EXT)
LED1/CFB_LDO0: R200.1 R235.1 R236.1 U2.33(LED1/CFG_LDO0)
LED2/CFB_LDO1: R205.1 R238.1 R239.1 U2.34(LED2/CFG_LDO1)
MDI0_N: R208.2 U2.2(MDI0-)
MDI0_P: R207.2 U2.1(MDI0+)
MDI1_N: R211.2 U2.5(MDI1-)
MDI1_P: R209.2 U2.4(MDI1+)
MDI2_N: R213.2 U2.7(MDI2-)
MDI2_P: R212.2 U2.6(MDI2+)
MDI3_N: R215.2 U2.10(MDI3-)
MDI3_P: R214.2 U2.9(MDI3+)
ORIN_INCLK: U2.20(TXC) ; off-sheet ORIN_INCLK  [project net RGMII_RXC]
ORIN_IND0: U2.18(TXD0) ; off-sheet ORIN_IND0  [project net RGMII_RD0]
ORIN_IND1: U2.17(TXD1) ; off-sheet ORIN_IND1  [project net RGMII_RD1]
ORIN_IND2: U2.16(TXD2) ; off-sheet ORIN_IND2  [project net RGMII_RD2]
ORIN_IND3: U2.15(TXD3) ; off-sheet ORIN_IND3  [project net RGMII_RD3]
ORIN_INDV: U2.19(TXCTL) ; off-sheet ORIN_INDV  [project net RGMII_RX_CTL]
ORIN_OUTD0: R222.1 R223.1 U2.25(RXD0/RXDLY) ; off-sheet ORIN_OUTD0  [also labelled RXDLY]  [project net RGMII_TD0]
ORIN_OUTD1: R224.1 R225.1 U2.24(RXD1/TXDLY) ; off-sheet ORIN_OUTD1  [also labelled TXDLY]  [project net RGMII_TD1]
ORIN_RTL8211_MDI0_N: R208.1 ; off-sheet ORIN_RTL8211_MDI0_N  [project net ORIN_RTL8111_MDI0_N]
ORIN_RTL8211_MDI0_P: R207.1 ; off-sheet ORIN_RTL8211_MDI0_P  [project net ORIN_RTL8111_MDI0_P]
ORIN_RTL8211_MDI1_N: R211.1 ; off-sheet ORIN_RTL8211_MDI1_N  [project net ORIN_RTL8111_MDI1_N]
ORIN_RTL8211_MDI1_P: R209.1 ; off-sheet ORIN_RTL8211_MDI1_P  [project net ORIN_RTL8111_MDI1_P]
ORIN_RTL8211_MDI2_N: R213.1 ; off-sheet ORIN_RTL8211_MDI2_N  [project net ORIN_RTL8111_MDI2_N]
ORIN_RTL8211_MDI2_P: R212.1 ; off-sheet ORIN_RTL8211_MDI2_P  [project net ORIN_RTL8111_MDI2_P]
ORIN_RTL8211_MDI3_N: R215.1 ; off-sheet ORIN_RTL8211_MDI3_N  [project net ORIN_RTL8111_MDI3_N]
ORIN_RTL8211_MDI3_P: R214.1 ; off-sheet ORIN_RTL8211_MDI3_P  [project net ORIN_RTL8111_MDI3_P]
PHYAD0: R216.1 R217.1 U2.22(RXD3/PHYAD0) ; off-sheet ORIN_OUTD3  [also labelled ORIN_OUTD3]
PHYAD1: R218.1 R219.1 U2.27(RXC/PHYAD1) ; off-sheet ORIN_OUTCLK  [also labelled ORIN_OUTCLK]
PHYAD2: R220.1 R221.1 U2.26(RXCTL/PHYAD2) ; off-sheet ORIN_OUTEN  [also labelled ORIN_OUTEN]
PLLOFF: R226.1 R227.1 U2.23(RXD2/PLLOFF) ; off-sheet ORIN_OUTD2  [also labelled ORIN_OUTD2]
XTAL_IN: R241.1 U2.36(XTAL_IN)
XTAL_OUT: R242.2 U2.37(XTAL_OUT/EXT_CLK)
NetAX1_1: AX1.1(XTALP) C61.1 R241.2
NetAX1_3: AX1.3(XTALN) C62.1 R242.1
NetC58_2: C58.2 R228.2 R229.2 R230.2 U2.12(PHYRSTB)
NetLED2_2: LED2.2(CATHODE) R198.2
NetLED3_2: LED3.2(CATHODE) R200.2
NetLED4_2: LED4.2(CATHODE) R205.2
NetR199_1: R199.1 U2.35(CLKOUT)
NetR202_2: R202.2 U2.39(RSET)
NetR203_2: R203.2 R204.1 U2.31(INTB/PMEB)
NetR231_2: R231.2 R232.2 U2.13(MDC)
NetR237_2: R237.2 R240.2 U2.14(MDIO)

Not connected (* = marked no-connect by the designer): R199 2

### Layout directives
differential pair: MDI0_N, MDI0_P, MDI1_N, MDI1_P, MDI2_N, MDI2_P, MDI3_N, MDI3_P, ORIN_RTL8111_MDI0_N, ORIN_RTL8111_MDI0_P, ORIN_RTL8111_MDI1_N, ORIN_RTL8111_MDI1_P, ORIN_RTL8111_MDI2_N, ORIN_RTL8111_MDI2_P, ORIN_RTL8111_MDI3_N, ORIN_RTL8111_MDI3_P

### Notes on the sheet
- ADRESS:2
- Note 1:
  (1) RXDLY Pull-High to add the delay to RXC for RXD latching.
  (2) PLLOFF pull-up to disable PLL ALDPS mode.
- Note 1:rgmii power is 3.3V  100
- (near *#5) Note 1: To reserve R18 for EMI consideration is recommended.
  Note 2: The value of C14/C15 depend on crystal requirement.
- C46 C47 C48 NEXT TO L11
- (in symbol LED_P2_Dup1) A; C
- (in symbol TitleBlock0) Title; Size; Document Number; Rev; Date:; Sheet; of

### Library data of the parts
*#5 = TitleBlock0: Page Create Date: March  8, 1995; Page Size: =PageSize; Page Modify Date: =ModifiedDate
AX1 = XTAL_0: Part Reference: AX3; PCB Footprint: CRY5032; Value: 25MHz
C58 = CAP NP_Dup4: Part Reference: C68; PCB Footprint: C0402
C59 = CAP NP_Dup4: Part Reference: C69; PCB Footprint: C0402
C60 = CAP NP_Dup4: Part Reference: C70; PCB Footprint: C0402
C61 = CAP NP_Dup3: Part Reference: C71; Value: 20pF/50V X7R; PCB Footprint: C0402
C62 = CAP NP_Dup3: Part Reference: C72; Value: 20pF/50V X7R; PCB Footprint: C0402
C63 = CAP_NP: CAP CER 10UF 10V 10% X5R 0603; Part Reference: C75; CLASS: DISCRETE; AGILE_PN: 150-78675; MFG_NAME01: TDK; MFG_PN01: C1608X5R1A106K; CAD_APPROVED: Yes; Tolerance: 10%; TOL: 10%; ROHS: Yes; HEIGHT: 1.016MM; VOLTAGE: 10v; PCB Footprint: C0603
C64 = CAP NP_Dup4: Part Reference: C76; PCB Footprint: C0402
C65 = CAP NP_Dup4: Part Reference: C77; PCB Footprint: C0402
C66 = CAP NP_Dup4: Part Reference: C73; PCB Footprint: C0402
C67 = CAP NP_Dup4: Part Reference: C74; PCB Footprint: C0402
C68 = CAP_NP: CAP CER 10UF 10V 10% X5R 0603; Part Reference: C78; CLASS: DISCRETE; CAD_APPROVED: Yes; MFG_PN01: C1608X5R1A106K; MFG_NAME01: TDK; AGILE_PN: 150-78675; VOLTAGE: 10v; HEIGHT: 1.016MM; ROHS: Yes; TOL: 10%; Tolerance: 10%; PCB Footprint: C0603
C69 = CAP NP_Dup4: Part Reference: C79; PCB Footprint: C0402
C70 = CAP NP_Dup4: Part Reference: C80; PCB Footprint: C0402
L1 L4 = BEAD: Part Reference: L14; Value1: BLM18KG300TN1D; PCB Footprint: L0603
L2 = BEAD: Part Reference: L16; Value1: BLM18KG300TN1D; PCB Footprint: L0603
L3 = Inductor: Code_IEC: 1005; Published: 8-Jun-2000; LatestRevisionDate: 29-May-2009; LatestRevisionNote: IPC-7351 Footprint Added.; PackageReference: 0402-A; Publisher: Altium Limited; PackageDescription: Chip Inductor; Code_JEITA: 0402
L5 = BEAD: Part Reference: L17; Value1: BLM18KG300TN1D; PCB Footprint: L0603
L6 = BEAD: Part Reference: L14; Value1: BLM18KG300TN1D; PCB Footprint: L0603
LED2 = LED_P2_Dup1: 0603表贴LED-黄绿-高亮-25mA-1.75~2.35V; Part Reference: LED3; Part Number: 20.31.00.0001.02; Partsort: CGJ; partgrade: 工业级; 物料名称: 0603-LED-绿/ROHS; 规格型号: 亿光_19-213/G6C-BM1N2B/3T; 物料封装: 0603; 计量单位: 只; 厂家（直接生产厂家或品牌）: 亿光; 物料状态(样品、试用、在用、限用): 常规; 替代优先等级: 1; ESD等级: HBM 2KV; MSD等级: 2级; 描述项1: 黄绿; 描述项2: 无色; 描述项3: 高亮; 描述项4: 25mA; 样品库: 样品库：2-4; 采购周期（天）: 30; Priority: 优选; Life State: 发布; Unit: pcs; Erpitem: 外购; Part Type: 0603表贴LED; 供应商(代理商): 都城亿光; 描述项5: 1.75~2.35V; Mfr Part Number: 亿光_19-213/G6C-BM1N2B/3T; Version: A.0; Failure Rate: 16.926597; Pdm Number: 20.31.00.0001.02; Partname: 0603-LED-绿/RoHS; Partlifeflag: 1; PCB Footprint: LED0603
LED3 = LED_P2_Dup1: 0603表贴LED-黄绿-高亮-25mA-1.75~2.35V; Part Reference: LED4; Part Number: 20.31.00.0001.02; Partsort: CGJ; partgrade: 工业级; 物料名称: 0603-LED-绿/ROHS; 规格型号: 亿光_19-213/G6C-BM1N2B/3T; 物料封装: 0603; 计量单位: 只; 厂家（直接生产厂家或品牌）: 亿光; 物料状态(样品、试用、在用、限用): 常规; 替代优先等级: 1; ESD等级: HBM 2KV; MSD等级: 2级; 描述项1: 黄绿; 描述项2: 无色; 描述项3: 高亮; 描述项4: 25mA; 样品库: 样品库：2-4; 采购周期（天）: 30; Priority: 优选; Life State: 发布; Unit: pcs; Erpitem: 外购; Part Type: 0603表贴LED; 供应商(代理商): 都城亿光; 描述项5: 1.75~2.35V; Mfr Part Number: 亿光_19-213/G6C-BM1N2B/3T; Version: A.0; Failure Rate: 16.926597; Pdm Number: 20.31.00.0001.02; Partname: 0603-LED-绿/RoHS; Partlifeflag: 1; PCB Footprint: LED0603
LED4 = LED_P2_Dup1: 0603表贴LED-黄绿-高亮-25mA-1.75~2.35V; Part Reference: LED5; Part Number: 20.31.00.0001.02; Partsort: CGJ; partgrade: 工业级; 物料名称: 0603-LED-绿/ROHS; 规格型号: 亿光_19-213/G6C-BM1N2B/3T; 物料封装: 0603; 计量单位: 只; 厂家（直接生产厂家或品牌）: 亿光; 物料状态(样品、试用、在用、限用): 常规; 替代优先等级: 1; ESD等级: HBM 2KV; MSD等级: 2级; 描述项1: 黄绿; 描述项2: 无色; 描述项3: 高亮; 描述项4: 25mA; 样品库: 样品库：2-4; 采购周期（天）: 30; Priority: 优选; Life State: 发布; Unit: pcs; Erpitem: 外购; Part Type: 0603表贴LED; 供应商(代理商): 都城亿光; 描述项5: 1.75~2.35V; Mfr Part Number: 亿光_19-213/G6C-BM1N2B/3T; Version: A.0; Failure Rate: 16.926597; Pdm Number: 20.31.00.0001.02; Partname: 0603-LED-绿/RoHS; Partlifeflag: 1; PCB Footprint: LED0603
R198 = RES_Dup2: AC0402FR-0710KL/YAGEO; Part Reference: R84; CLASS: DISCRETE; PCB Footprint: R0402
R199 = R_Dup3: Part Reference: R85; PCB Footprint: R0402
R200 = RES_Dup2: AC0402FR-0710KL/YAGEO; Part Reference: R86; CLASS: DISCRETE; PCB Footprint: R0402
R202 = RESISTOR: Part Reference: R88; PCB Footprint: R0402
R203 = RESISTOR: Part Reference: R95; PCB Footprint: R0402
R204 = R_Dup3: Part Reference: R96; PCB Footprint: R0402
R205 = RES_Dup2: AC0402FR-0710KL/YAGEO; Part Reference: R90; CLASS: DISCRETE; PCB Footprint: R0402
R207 = RES_Dup2: AC0402FR-070RL/YAGEO; Part Reference: R97; CLASS: DISCRETE; SIGNAL_MODEL: DEFAULT_RESISTOR_33.000000OHM_2_1; FPLIST: RC0603_OV; CAD_APPROVED: Yes; MFG_PN01: CR-02FL6---33R; MFG_NAME01: YAGEO; Tolerance: 1%; AGILE_PN: 470-75790; TOL: 5%; ROHS: Yes; HEIGHT: 0.4MM; PCB Footprint: R0402
R208 = RES_Dup2: AC0402FR-070RL/YAGEO; Part Reference: R98; CLASS: DISCRETE; TOL: 5%; AGILE_PN: 470-75790; Tolerance: 1%; MFG_NAME01: YAGEO; MFG_PN01: CR-02FL6---33R; CAD_APPROVED: Yes; FPLIST: RC0603_OV; SIGNAL_MODEL: DEFAULT_RESISTOR_33.000000OHM_2_1; HEIGHT: 0.4MM; ROHS: Yes; PCB Footprint: R0402
R209 = RES_Dup2: AC0402FR-070RL/YAGEO; Part Reference: R99; CLASS: DISCRETE; TOL: 5%; AGILE_PN: 470-75790; Tolerance: 1%; MFG_NAME01: YAGEO; MFG_PN01: CR-02FL6---33R; CAD_APPROVED: Yes; FPLIST: RC0603_OV; SIGNAL_MODEL: DEFAULT_RESISTOR_33.000000OHM_2_1; HEIGHT: 0.4MM; ROHS: Yes; PCB Footprint: R0402
R211 = RES_Dup2: AC0402FR-070RL/YAGEO; Part Reference: R101; CLASS: DISCRETE; TOL: 5%; AGILE_PN: 470-75790; Tolerance: 1%; MFG_NAME01: YAGEO; MFG_PN01: CR-02FL6---33R; CAD_APPROVED: Yes; FPLIST: RC0603_OV; SIGNAL_MODEL: DEFAULT_RESISTOR_33.000000OHM_2_1; HEIGHT: 0.4MM; ROHS: Yes; PCB Footprint: R0402
R212 = RES_Dup2: AC0402FR-070RL/YAGEO; Part Reference: R102; CLASS: DISCRETE; TOL: 5%; AGILE_PN: 470-75790; Tolerance: 1%; MFG_NAME01: YAGEO; MFG_PN01: CR-02FL6---33R; CAD_APPROVED: Yes; FPLIST: RC0603_OV; SIGNAL_MODEL: DEFAULT_RESISTOR_33.000000OHM_2_1; HEIGHT: 0.4MM; ROHS: Yes; PCB Footprint: R0402
R213 = RES_Dup2: AC0402FR-070RL/YAGEO; Part Reference: R103; CLASS: DISCRETE; TOL: 5%; AGILE_PN: 470-75790; Tolerance: 1%; MFG_NAME01: YAGEO; MFG_PN01: CR-02FL6---33R; CAD_APPROVED: Yes; FPLIST: RC0603_OV; SIGNAL_MODEL: DEFAULT_RESISTOR_33.000000OHM_2_1; HEIGHT: 0.4MM; ROHS: Yes; PCB Footprint: R0402
R214 = RES_Dup2: AC0402FR-070RL/YAGEO; Part Reference: R104; CLASS: DISCRETE; TOL: 5%; AGILE_PN: 470-75790; Tolerance: 1%; MFG_NAME01: YAGEO; MFG_PN01: CR-02FL6---33R; CAD_APPROVED: Yes; FPLIST: RC0603_OV; SIGNAL_MODEL: DEFAULT_RESISTOR_33.000000OHM_2_1; HEIGHT: 0.4MM; ROHS: Yes; PCB Footprint: R0402
R215 = RES_Dup2: AC0402FR-070RL/YAGEO; Part Reference: R105; CLASS: DISCRETE; TOL: 5%; AGILE_PN: 470-75790; Tolerance: 1%; MFG_NAME01: YAGEO; MFG_PN01: CR-02FL6---33R; CAD_APPROVED: Yes; FPLIST: RC0603_OV; SIGNAL_MODEL: DEFAULT_RESISTOR_33.000000OHM_2_1; HEIGHT: 0.4MM; ROHS: Yes; PCB Footprint: R0402
R216 = RES_Dup2: RES MF 4.7K 1/16W 5% 0402; Part Reference: R106; CLASS: DISCRETE; AGILE_PN: 470-75626; MFG_NAME01: KOA SPEER; MFG_PN01: RK73B1ETTP472J; CAD_APPROVED: Yes; FPLIST: RC0402_25,RC0402_HD,RC0402_CC; HEIGHT: 0.41mm; TOL: 5%; Tolerance: 5%; ROHS: Yes; PCB Footprint: R0402
R217 = RESISTOR: Part Reference: R107; PCB Footprint: R0402
R218 = RES_Dup2: RES MF 4.7K 1/16W 5% 0402; Part Reference: R108; CLASS: DISCRETE; FPLIST: RC0402_25,RC0402_HD,RC0402_CC; CAD_APPROVED: Yes; MFG_PN01: RK73B1ETTP472J; MFG_NAME01: KOA SPEER; AGILE_PN: 470-75626; ROHS: Yes; Tolerance: 5%; TOL: 5%; HEIGHT: 0.41mm; PCB Footprint: R0402
R219 = RESISTOR: Part Reference: R109; PCB Footprint: R0402
R220 = RES_Dup2: RES MF 4.7K 1/16W 5% 0402; Part Reference: R110; CLASS: DISCRETE; FPLIST: RC0402_25,RC0402_HD,RC0402_CC; CAD_APPROVED: Yes; MFG_PN01: RK73B1ETTP472J; MFG_NAME01: KOA SPEER; AGILE_PN: 470-75626; ROHS: Yes; Tolerance: 5%; TOL: 5%; HEIGHT: 0.41mm; PCB Footprint: R0402
R221 = RESISTOR: Part Reference: R111; PCB Footprint: R0402
R222 = RES_Dup2: RES MF 4.7K 1/16W 5% 0402; Part Reference: R112; CLASS: DISCRETE; AGILE_PN: 470-75626; MFG_NAME01: KOA SPEER; MFG_PN01: RK73B1ETTP472J; CAD_APPROVED: Yes; FPLIST: RC0402_25,RC0402_HD,RC0402_CC; HEIGHT: 0.41mm; TOL: 5%; Tolerance: 5%; ROHS: Yes; PCB Footprint: R0402
R223 = RESISTOR: Part Reference: R113; PCB Footprint: R0402
R224 = RES_Dup2: RES MF 4.7K 1/16W 5% 0402; Part Reference: R114; CLASS: DISCRETE; AGILE_PN: 470-75626; MFG_NAME01: KOA SPEER; MFG_PN01: RK73B1ETTP472J; CAD_APPROVED: Yes; FPLIST: RC0402_25,RC0402_HD,RC0402_CC; HEIGHT: 0.41mm; TOL: 5%; Tolerance: 5%; ROHS: Yes; PCB Footprint: R0402
R225 = RESISTOR: Part Reference: R115; PCB Footprint: R0402
R226 = RES_Dup2: RES MF 4.7K 1/16W 5% 0402; Part Reference: R116; CLASS: DISCRETE; AGILE_PN: 470-75626; MFG_NAME01: KOA SPEER; MFG_PN01: RK73B1ETTP472J; CAD_APPROVED: Yes; FPLIST: RC0402_25,RC0402_HD,RC0402_CC; HEIGHT: 0.41mm; TOL: 5%; Tolerance: 5%; ROHS: Yes; PCB Footprint: R0402
R227 = RESISTOR: Part Reference: R117; PCB Footprint: R0402
R228 R231 = RESISTOR: Part Reference: R120; PCB Footprint: R0402
R229 = RESISTOR: Part Reference: R118; PCB Footprint: R0402
R230 = R_Dup3: Part Reference: R119; PCB Footprint: R0402
R232 = R_Dup3: Part Reference: R121; PCB Footprint: R0402
R233 = RES_Dup2: RES MF 4.7K 1/16W 5% 0402; Part Reference: R122; CLASS: DISCRETE; FPLIST: RC0402_25,RC0402_HD,RC0402_CC; CAD_APPROVED: Yes; MFG_PN01: RK73B1ETTP472J; MFG_NAME01: KOA SPEER; AGILE_PN: 470-75626; ROHS: Yes; Tolerance: 5%; TOL: 5%; HEIGHT: 0.41mm; PCB Footprint: R0402
R234 = RESISTOR: Part Reference: R123; PCB Footprint: R0402
R235 = RES_Dup2: RES MF 4.7K 1/16W 5% 0402; Part Reference: R124; CLASS: DISCRETE; AGILE_PN: 470-75626; MFG_NAME01: KOA SPEER; MFG_PN01: RK73B1ETTP472J; CAD_APPROVED: Yes; FPLIST: RC0402_25,RC0402_HD,RC0402_CC; HEIGHT: 0.41mm; TOL: 5%; Tolerance: 5%; ROHS: Yes; PCB Footprint: R0402
R236 = RESISTOR: Part Reference: R125; PCB Footprint: R0402
R237 = RESISTOR: Part Reference: R126; PCB Footprint: R0402
R238 = RES_Dup2: RES MF 4.7K 1/16W 5% 0402; Part Reference: R127; CLASS: DISCRETE; FPLIST: RC0402_25,RC0402_HD,RC0402_CC; CAD_APPROVED: Yes; MFG_PN01: RK73B1ETTP472J; MFG_NAME01: KOA SPEER; AGILE_PN: 470-75626; ROHS: Yes; Tolerance: 5%; TOL: 5%; HEIGHT: 0.41mm; PCB Footprint: R0402
R239 = RESISTOR: Part Reference: R128; PCB Footprint: R0402
R240 = R_Dup3: Part Reference: R129; PCB Footprint: R0402
R241 = R_Dup3: Part Reference: R130; PCB Footprint: R0402
R242 = R_Dup3: Part Reference: R131; PCB Footprint: R0402
U2 = TL8211FDI: Part Reference: U5; PCB Footprint: QFN40-RTL8211F